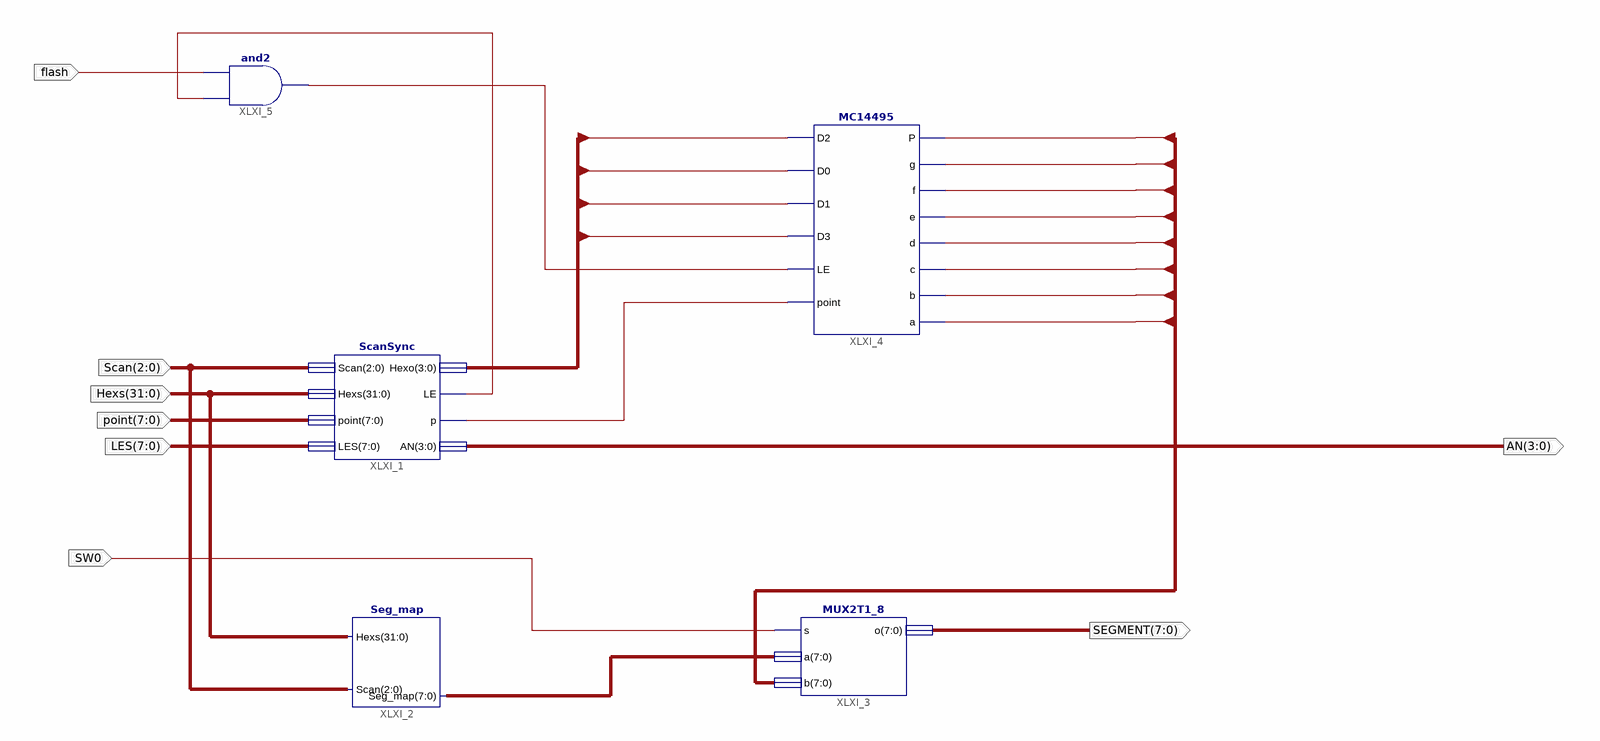
[diagram p0: schematic sheet 1]
// Xilinx ISE schematic Seg7_Dev.sch (kintex7) as structural Verilog: 5 symbols, 8 ports
module Seg7_Dev (
  input  [2:0] Scan,
  input  [31:0] Hexs,
  input  [7:0] point,
  input  [7:0] LES,
  input  SW0,
  input  flash,
  output [7:0] SEGMENT,
  output [3:0] AN
);

  wire XLXN_9, XLXN_12, XLXN_13;
  wire [3:0] Hex;
  wire [7:0] SEG_TXT, XLXN_8;

  ScanSync XLXI_1 (.Scan(Scan), .Hexs(Hexs), .point(point), .LES(LES), .Hexo(Hex), .LE(XLXN_12), .p(XLXN_9), .AN(AN));
  Seg_map XLXI_2 (.Hexs(Hexs), .Seg_map(XLXN_8), .Scan(Scan));
  MUX2T1_8 XLXI_3 (.s(SW0), .a(XLXN_8), .b(SEG_TXT), .o(SEGMENT));
  MC14495 XLXI_4 (
    .D2(Hex[2]), .D0(Hex[0]), .D1(Hex[1]), .D3(Hex[3]), .LE(XLXN_13), .point(XLXN_9), .P(SEG_TXT[7]),
    .g(SEG_TXT[6]), .f(SEG_TXT[5]), .e(SEG_TXT[4]), .d(SEG_TXT[3]), .c(SEG_TXT[2]), .b(SEG_TXT[1]),
    .a(SEG_TXT[0]));
  and XLXI_5 (XLXN_13, XLXN_12, flash);
endmodule
